# Altium project Megabit revision 2.PrjPcb
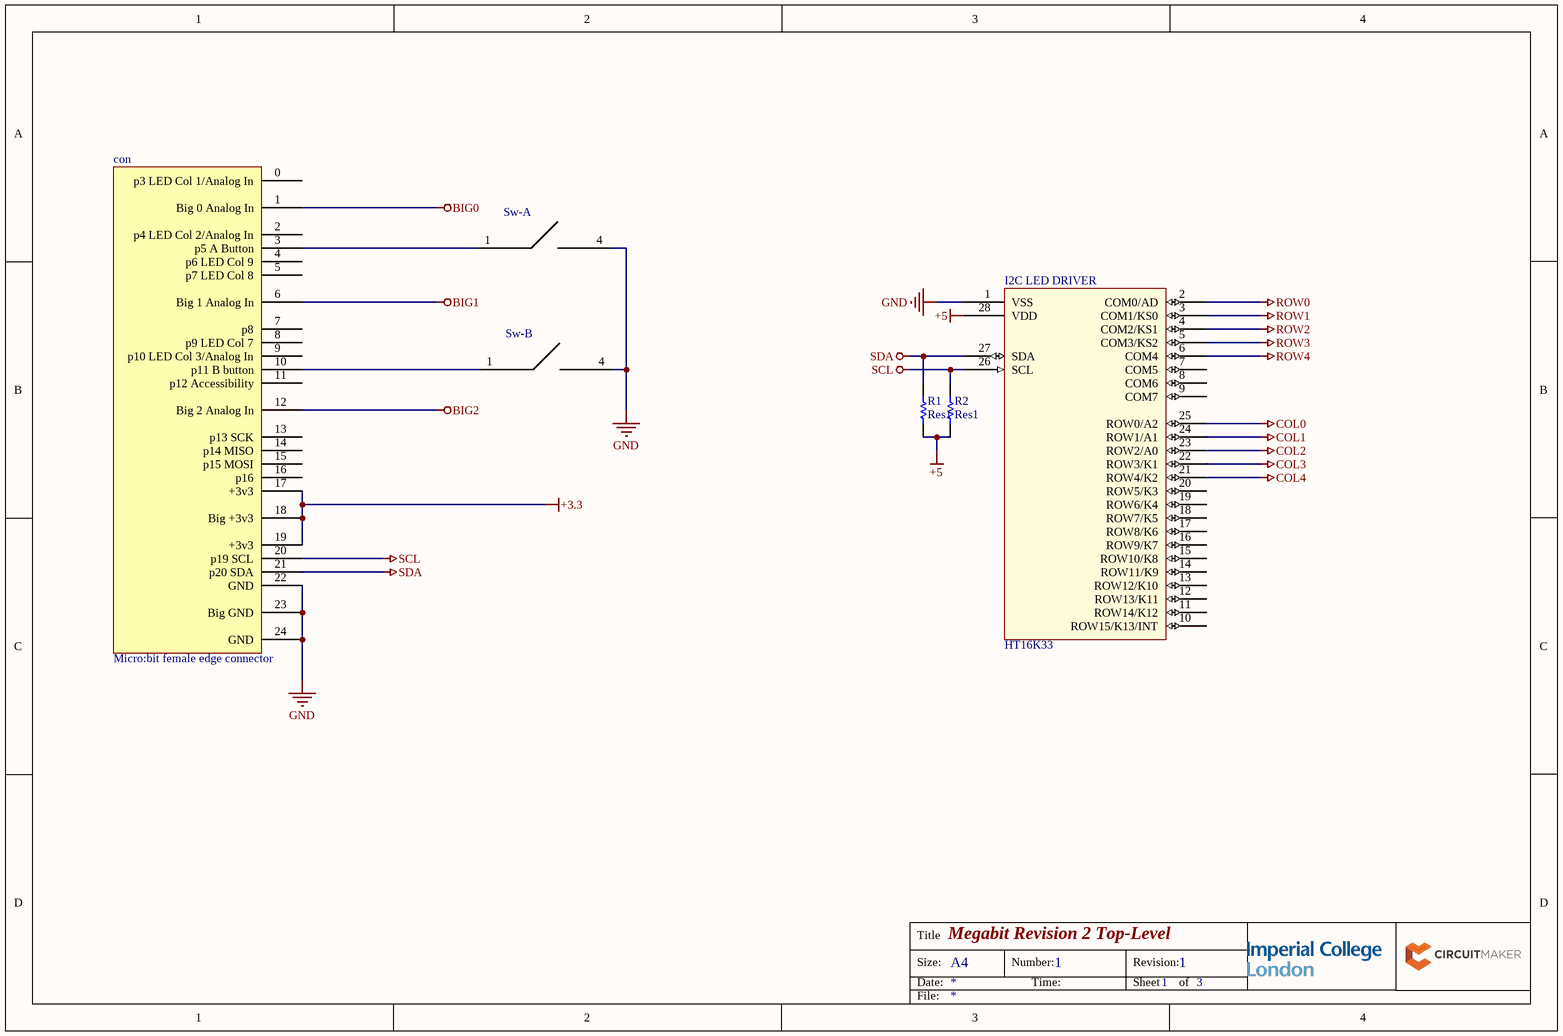
[diagram p0: megabit rev2 top.SchDoc]
3 sheets, 51 parts. Net scope: global (net labels, ports and power ports of the same name join across sheets).
Sheets:
  megabit rev2 top.SchDoc
  LED matrix.SchDoc
  Power.SchDoc

## Sheet megabit rev2 top.SchDoc: Megabit Revision 2 Top-Level
size A4; DrawnBy: Megabit Team; DocumentNumber: 1; Revision: 1; SheetNumber: 1; SheetTotal: 3

### Parts
con  Micro:bit female edge connector  [PCBComponent_1 - duplicate]
I2C_LED_DRIVER  HT16K33  [PCB-otwcc1b496jwxezlenqc-1]
R1  Res1  [PCB-3613466-1]
R2  Res1  [PCB-3613466-1]
Sw-A  TE Connectivity (Tyco Electronics) / ALCOSWITCH FSM4JSMATR  [PCB-1274972-1]  (value not drawn)
Sw-B  TE Connectivity (Tyco Electronics) / ALCOSWITCH FSM4JSMATR  [PCB-1274972-1]  (value not drawn)

### Nets
+3.3: con.17(+3v3) con.18(Big_+3v3) con.19(+3v3)
+5: I2C_LED_DRIVER.28(VDD) R1.1 R2.1
BIG0: con.1(Big_0_Analog_In)
BIG1: con.6(Big_1_Analog_In)
BIG2: con.12(Big_2_Analog_In)
COL0: I2C_LED_DRIVER.25(ROW0/A2)
COL1: I2C_LED_DRIVER.24(ROW1/A1)
COL2: I2C_LED_DRIVER.23(ROW2/A0)
COL3: I2C_LED_DRIVER.22(ROW3/K1)
COL4: I2C_LED_DRIVER.21(ROW4/K2)
GND: con.22(GND) con.23(Big_GND) con.24(GND) I2C_LED_DRIVER.1(VSS) Sw-A.4 Sw-B.4
ROW0: I2C_LED_DRIVER.2(COM0/AD)
ROW1: I2C_LED_DRIVER.3(COM1/KS0)
ROW2: I2C_LED_DRIVER.4(COM2/KS1)
ROW3: I2C_LED_DRIVER.5(COM3/KS2)
ROW4: I2C_LED_DRIVER.6(COM4)
SCL: con.20(p19_SCL) I2C_LED_DRIVER.26(SCL) R2.2
SDA: con.21(p20_SDA) I2C_LED_DRIVER.27(SDA) R1.2
Netcon_3: con.3(p5_A_Button) Sw-A.1
Netcon_10: con.10(p11_B_button) Sw-B.1

Not connected (* = marked no-connect by the designer): con 0(p3_LED_Col_1/Analog_In) 2(p4_LED_Col_2/Analog_In) 4(p6_LED_Col_9) 5(p7_LED_Col_8) 7(p8) 8(p9_LED_Col_7) 9(p10_LED_Col_3/Analog_In) 11(p12_Accessibility) 13(p13_SCK) 14(p14_MISO) 15(p15_MOSI) 16(p16); I2C_LED_DRIVER 7(COM5) 8(COM6) 9(COM7) 10(ROW15/K13/INT) 11(ROW14/K12) 12(ROW13/K11) 13(ROW12/K10) 14(ROW11/K9) 15(ROW10/K8) 16(ROW9/K7) 17(ROW8/K6) 18(ROW7/K5) 19(ROW6/K4) 20(ROW5/K3)

### Notes on the sheet
- Title
- Size:
- Date:
- A4
- Number:
- Time:
- Revision:
- Sheet
- of
- File:

### Library data of the parts
con = CMP-mom7rix79jkpy4z4w6go-14: http://www.dgyuliang.net/html/279.html; CustomComponentID: mom7rix79jkpy4z4w6go
I2C_LED_DRIVER = CMP-58709250411787b7-2: 3M(TM) Stikit(TM) Gold Disc Roll, 01427, 5 in, P100A, 125 discs per roll, 10 rolls per case; REACH SVHC Compliance: No SVHC
R1 R2 = CMP-b15c796618a36e9b-3: Resistor 0.25W; OctopartID: b15c796618a36e9b
Sw-A Sw-B = CMP-1274972-10: SWITCH TACTILE SPST-NO 0.05A 24V; ELV Compliant: Compliant; Contacts Type: SPST; Lead-Free Status: Lead Free; Lifecycle Status: Active; OctopartID: 00c5cb91b7abdf02; RoHS: Compliant; Contact Plating: Silver; Mounting Style: PCB; REACH SVHC Compliance: No SVHC; Octopart Url: https://octopart.com/fsm4jsmatr-alco-1061461; Contact Material: Copper Alloy; Contact Current Rating: 0.05 A; Packaging: Tape & Reel (TR)

## Sheet LED matrix.SchDoc: Megabit LED Matrix
size A4; DocumentNumber: 2; Revision: 1; SheetNumber: 2; SheetTotal: 3
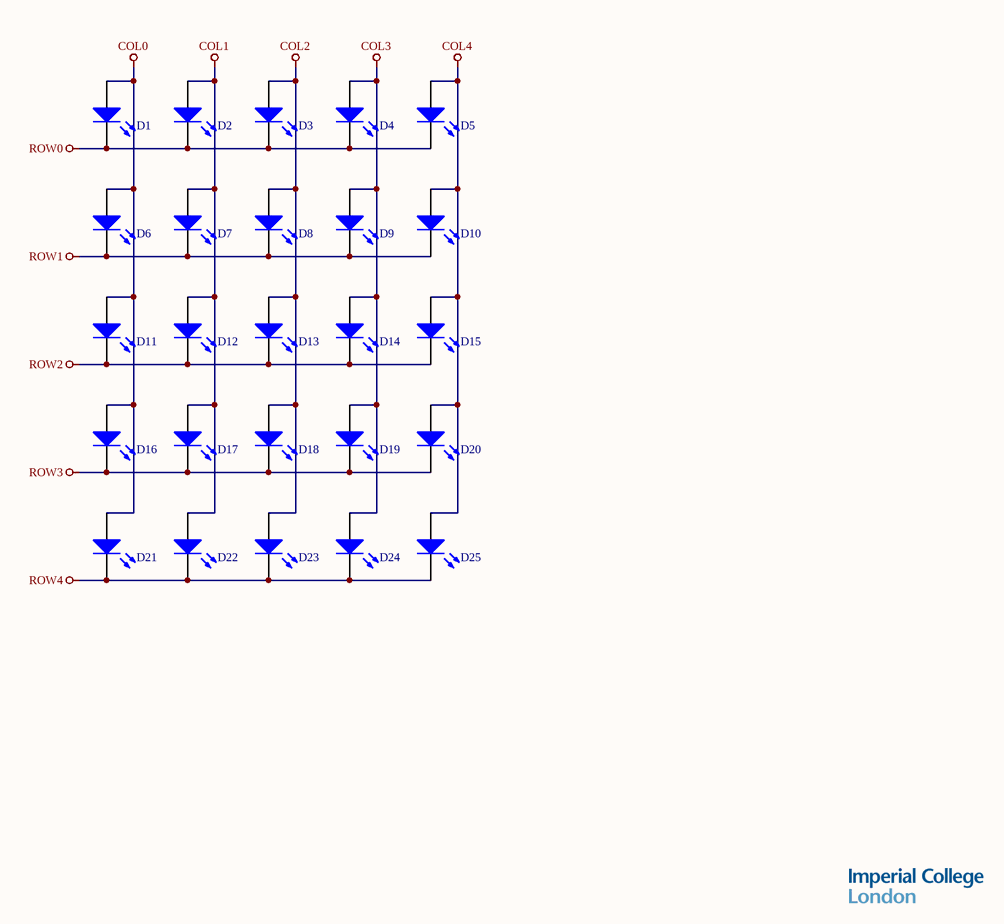
[diagram p1: LED matrix.SchDoc]

### Parts
(Parts that share a designator on the sheet are numbered #1, #2 ... from top to bottom, then left to right.)
D1#1  LED  [PCB-pjce6c538hbnjhyboevm-1]  (value not drawn)
D2  LED  [PCB-pjce6c538hbnjhyboevm-1]  (value not drawn)
D3  LED  [PCB-pjce6c538hbnjhyboevm-1]  (value not drawn)
D4  LED  [PCB-pjce6c538hbnjhyboevm-1]  (value not drawn)
D5  LED  [PCB-pjce6c538hbnjhyboevm-1]  (value not drawn)
D6  LED  [PCB-pjce6c538hbnjhyboevm-1]  (value not drawn)
D7  LED  [PCB-pjce6c538hbnjhyboevm-1]  (value not drawn)
D8  LED  [PCB-pjce6c538hbnjhyboevm-1]  (value not drawn)
D9  LED  [PCB-pjce6c538hbnjhyboevm-1]  (value not drawn)
D10  LED  [PCB-pjce6c538hbnjhyboevm-1]  (value not drawn)
D11  LED  [PCB-pjce6c538hbnjhyboevm-1]  (value not drawn)
D12  LED  [PCB-pjce6c538hbnjhyboevm-1]  (value not drawn)
D13  LED  [PCB-pjce6c538hbnjhyboevm-1]  (value not drawn)
D14  LED  [PCB-pjce6c538hbnjhyboevm-1]  (value not drawn)
D15  LED  [PCB-pjce6c538hbnjhyboevm-1]  (value not drawn)
D16  LED  [PCB-pjce6c538hbnjhyboevm-1]  (value not drawn)
D17  LED  [PCB-pjce6c538hbnjhyboevm-1]  (value not drawn)
D18  LED  [PCB-pjce6c538hbnjhyboevm-1]  (value not drawn)
D19  LED  [PCB-pjce6c538hbnjhyboevm-1]  (value not drawn)
D20  LED  [PCB-pjce6c538hbnjhyboevm-1]  (value not drawn)
D21  LED  [PCB-pjce6c538hbnjhyboevm-1]  (value not drawn)
D22  LED  [PCB-pjce6c538hbnjhyboevm-1]  (value not drawn)
D23  LED  [PCB-pjce6c538hbnjhyboevm-1]  (value not drawn)
D24  LED  [PCB-pjce6c538hbnjhyboevm-1]  (value not drawn)
D25  LED  [PCB-pjce6c538hbnjhyboevm-1]  (value not drawn)

### Nets
COL0: D1#1.1(A) D6.1(A) D11.1(A) D16.1(A) D21.1(A)
COL1: D2.1(A) D7.1(A) D12.1(A) D17.1(A) D22.1(A)
COL2: D3.1(A) D8.1(A) D13.1(A) D18.1(A) D23.1(A)
COL3: D4.1(A) D9.1(A) D14.1(A) D19.1(A) D24.1(A)
COL4: D5.1(A) D10.1(A) D15.1(A) D20.1(A) D25.1(A)
ROW0: D1#1.2(K) D2.2(K) D3.2(K) D4.2(K) D5.2(K)
ROW1: D6.2(K) D7.2(K) D8.2(K) D9.2(K) D10.2(K)
ROW2: D11.2(K) D12.2(K) D13.2(K) D14.2(K) D15.2(K)
ROW3: D16.2(K) D17.2(K) D18.2(K) D19.2(K) D20.2(K)
ROW4: D21.2(K) D22.2(K) D23.2(K) D24.2(K) D25.2(K)

### Notes on the sheet
- Title
- Size:
- Date:
- A4
- Number:
- Time:
- Revision:
- Sheet
- of
- File:

### Library data of the parts
D1#1 D2-D25 = CMP-c7440e1cac271883-2: L-793SRD-E, Round Series Red LED, 640 nm 8 mm, Round Lens Through Hole package; Lens Type: Diffused; Viewing Angle: 30 °; Wavelength: 640 nm; Octopart URL: https://octopart.com/l-793srd-e-kingbright-5393925; Operating Temperature: -40.0 °C to 85.0 °C; RoHS: Compliant; Mounting Style: Through Hole, PCB; REACH SVHC Compliance: No SVHC; Manufacturer Part Number: L-793SRD-E

## Sheet Power.SchDoc: Megabit Revision 2 Power
size A4; DocumentNumber: 3; Revision: 1; SheetNumber: 3; SheetTotal: 3
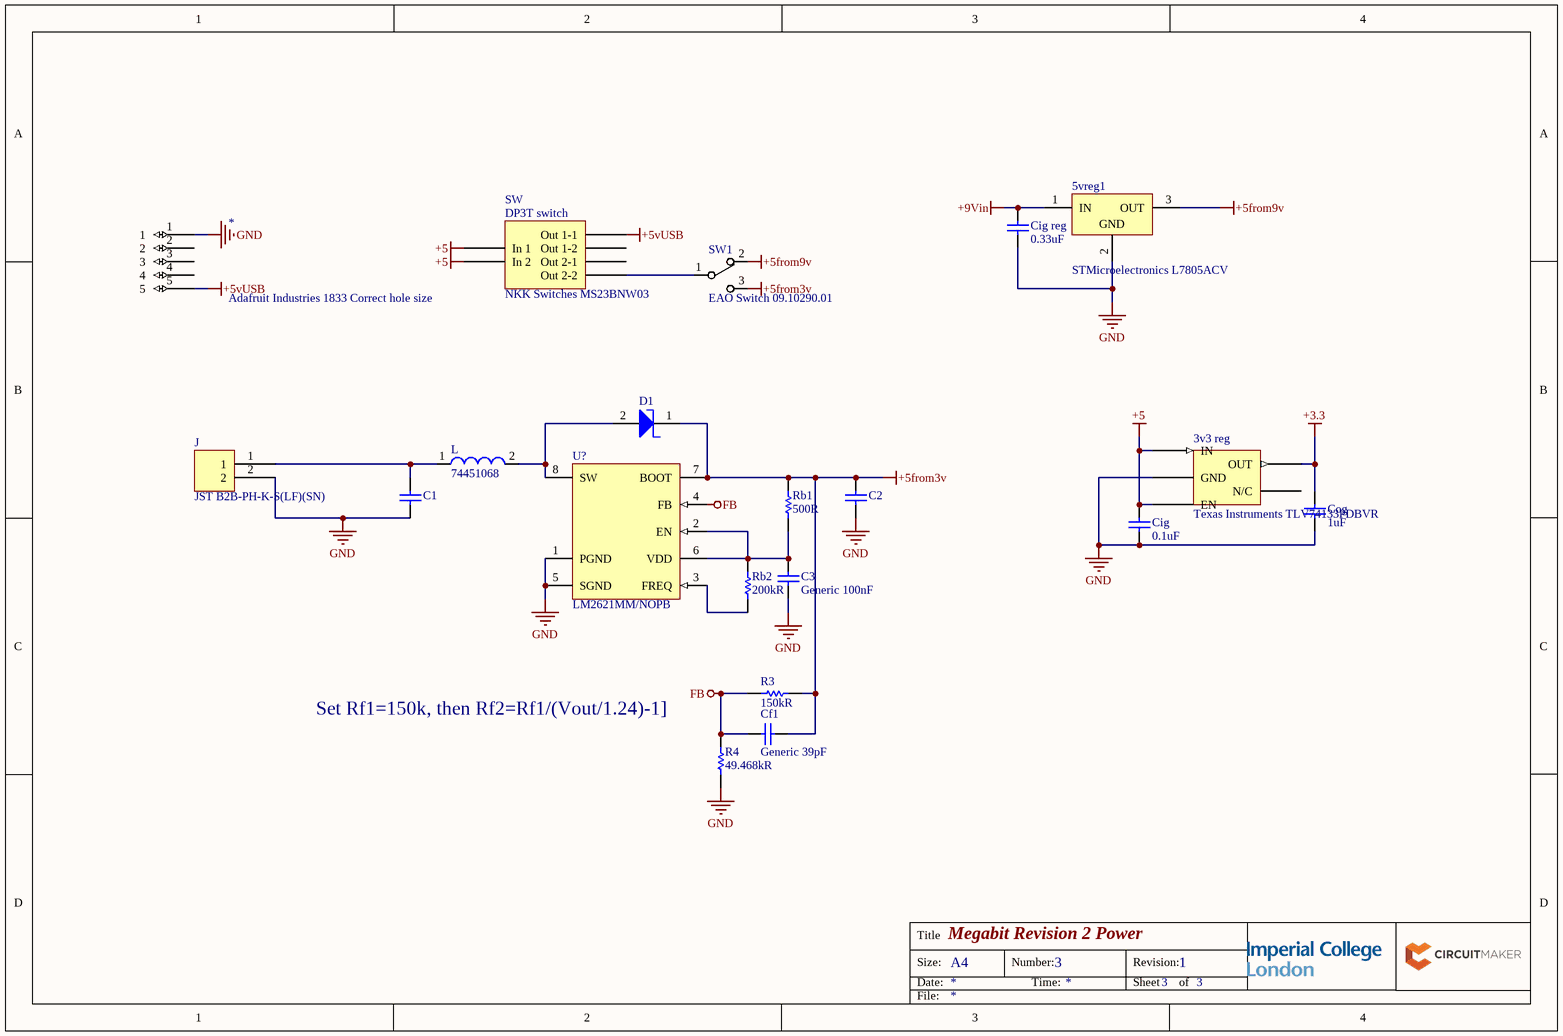
[diagram p2: Power.SchDoc]

### Parts
(Parts that share a designator on the sheet are numbered #1, #2 ... from top to bottom, then left to right.)
3v3_reg  Texas Instruments TLV74133PDBVR  [PCB-e30blpvsozc7nnftiis2-1]
5vreg1  STMicroelectronics L7805ACV  [PCB-rumztmkd2xxusznmwboq-1]
*  Adafruit Industries 1833 Correct hole size  [PCB-lrx1ysvqy1j2hi3n37c6-1]
C1  Vishay 595D226X06R3B2T 22uf  [PCB-awioszezn6dp9j1rjqrs-1]  (value not drawn)
C2  Vishay 595D686X0010C2T 68uf  [PCB-d73fplpdo6xzmazju0mb-1]  (value not drawn)
C3  Generic 100nF  [CAPC3225X270X50NL20T25]
Cf1  Generic 39pF  [CAPC3225X270X50NL20T25]
Cig  0.1uF  [Vishay K104K15X7RF5TL2]
Cig_reg  0.33uF  [Vishay K104K15X7RF5TL2]
Cog  1uF  [Vishay K104K15X7RF5TL2]
D1#2  Diode  [PCB-z7pk77sri5opvcrttliy-1]  (value not drawn)
J  JST B2B-PH-K-S(LF)(SN)  [PCB-gpdi66yn1jko56crxrq7-1]
L  74451068  [WE-PD3-S]
R3  150kR  [PCB-3613466-1]
R4  49.468kR  [PCB-3613466-1]
Rb1  500R  [PCB-3613466-1]
Rb2  200kR  [PCB-3613466-1]
SW  NKK Switches MS23BNW03  [PCB-eozfiwzr1uk89188ni00-1]
SW1  EAO Switch 09.10290.01  [PCB-1akl86m7w5ikau1ha4dm-1]
U?  LM2621MM/NOPB  [MUA08A_M]

### Nets
+3.3: 3v3_reg.4(OUT) Cog.2
+5: 3v3_reg.1(IN) 3v3_reg.3(EN) Cig.2 SW.2(In_1) SW.5(In_2)
+5from3v: C2.2 Cf1.1 D1#2.1(K) R3.1 Rb1.2 SW1.3 U?.7(BOOT)
+5from9v: 5vreg1.3(OUT) SW1.2
+5vUSB: *.5 SW.1(Out_1-1)
+9Vin: 5vreg1.1(IN) Cig_reg.2
FB: Cf1.2 R3.2 R4.1 U?.4(FB)
GND: 3v3_reg.2(GND) 5vreg1.2(GND) *.1 C1.1 C2.1 C3.1 Cig.1 Cig_reg.1 Cog.1 J.2 R4.2 U?.1(PGND) U?.5(SGND)
NetC1_2: C1.2 J.1 L.1
NetC3_2: C3.2 Rb1.1 Rb2.2 U?.2(EN) U?.6(VDD)
NetD1#2_2: D1#2.2(A) L.2 U?.8(SW)
NetRb2_1: Rb2.1 U?.3(FREQ)
NetSW_6: SW.6(Out_2-2) SW1.1

Not connected (* = marked no-connect by the designer): 3v3_reg 5(N/C); * 2 3 4; SW 3(Out_1-2) 4(Out_2-1)

### Notes on the sheet
- (near R4) Set Rf1=150k, then Rf2=Rf1/(Vout/1.24)-1]
- Title
- Size:
- Date:
- A4
- Number:
- Time:
- Revision:
- Sheet
- of
- File:
- (in symbol CMP-e82c21266ecb37eb-4) DP3T switch

### Library data of the parts
3v3_reg = CMP-ad66616159c672a1-4: 150mA Low-Dropout (LDO) Regulator With Foldback Current Limit for Portable Devices 5-SOT-23 -40 to 125; Dropout Voltage: 230 mV; Quiescent Current: 50.0 µA; Number of Regulated Outputs: 1; Output Capacitor Type: Ceramic; RoHS: Compliant; Octopart URL: https://octopart.com/tlv74133pdbvr-texas+instruments-84791750; Operating Temperature: -40.0 °C to 125 °C; OctopartID: ad66616159c672a1; Manufacturer Part Number: TLV74133PDBVR; Number of Pins: 5; Lifecycle Status: Pre-Release; Case/Package: SOT-23
5vreg1 = CMP-1170713-16: L7805 Series 1.5 A 5 V Three Terminal Voltage Regulator - TO-220; Dropout Voltage: 2.00 V; Output Voltage: 5.00 V (max); Number of Outputs: 1; Input Voltage (DC): 20.0 V (max); Lead-Free Status: Lead Free; Output Current: 1.00 A, 1.50 A; OctopartID: b0837beb020f6f44; Operating Temperature: 0.00 °C to 150 °C; Mounting Style: Through Hole; Manufacturer Part Number: L7805ACV; Lifecycle Status: Active; REACH SVHC Compliance: No SVHC; Case/Package: TO-220; RoHS: Compliant; Number of Pins: 3; Packaging: Tube; Octopart URL: https://octopart.com/l7805acv-stmicroelectronics-40015850
* = CMP-bfb17591a6f36076-2: Standoff; Threaded Female 1/4 Hex; 6-32 Thread; Length .875; Brass/Zinc; Manufacturer Part Number: 1833; Lead-Free Status: Lead Free; OctopartID: bfb17591a6f36076; Size-Width: 6.35 mm; Size-Diameter: 6.35 mm; Octopart URL: http://octopart.com/1833-adafruit+industries-53099556; Material: Brass; Size-Length: 22.2 mm; Gender: Female; RoHS: Compliant
C1 = CMP-0470cff745dfdbb7-1: Cap Tant Solid 22uF 6.3V B CASE 20% (4 X 2.8 X 1.9mm) SMD 0.57 Ohm 125°C T/R; Octopart URL: https://octopart.com/595d226x06r3b2t-vishay-42820809; Manufacturer Part Number: 595D226X06R3B2T; Mounting Style: Surface Mount; Packaging: Reel; OctopartID: 0470cff745dfdbb7
C2 = CMP-af556406ccca7092-1: Capacitor; Tantalum; Cap 68 uF; Tol 20%; Vol-Rtg 10 VDC; SMT; ESR 0.24 Ohms; Case C; Capacitance: 68.0 µF; Equivalent Series Resistance (ESR): 240 m?; Lead-Free Status: Lead Free; Voltage Rating (DC): 10.0 V; Octopart URL: https://octopart.com/595d686x0010c2t-vishay-39405305; Manufacturer Part Number: 595D686X0010C2T; Capacitance Tolerance: ±20%; Dielectric Material: Tantalum; Mounting Style: Surface Mount, PCB; Operating Temperature: -55.0 °C to 85.0 °C; Packaging: Reel; Number of Pins: 2; RoHS: Compliant; OctopartID: af556406ccca7092
C3 Cf1 = CMP-7582759-2: Cap Ceramic 22uF 6.3V X7R 10% SMD 1210 125C Plastic T/R; Capacitance: 2.2e-05 F; Lead-Free Status: R; Capacitance Tolerance: ±10%; Case/Package: 1210; Dielectric Characteristic: X7R; Dielectric Material: Ceramic; Mounting Style: Surface Mount; Octopart Url: https://octopart.com/c1210c226k9rac7800-kemet-25529306; OctopartID: 3960f1ef97dce6a7; RoHS: Compliant; Voltage Rating (DC): 6.3 V
Cig Cig_reg Cog = CMP-124240-16: K Series 100nF 50 V ±10 % Tolerance X7R Radial Multilayer Ceramic Capacitor; Manufacturer Part Number: K104K15X7RF5TL2; Lead Length: 30mm; Lead-Free Status: Lead Free; Voltage Rating (DC): 50 V; Capacitance Tolerance: ±10%; Size-Height: 5.6mm; Size-Width: 4.0mm; Mounting Style: Through Hole; OctopartID: e7292e20c87538ee; Number of Pins: 2; Packaging: Cut Tape (CT), Tape & Reel (TR); Capacitance: 100 nF; Octopart URL: http://octopart.com/k104k15x7rf5tl2-vishay+bccomponents-199226; Dielectric Material: Ceramic; Dielectric Characteristic: X7R; Size-Lead Diameter: 0.5mm; RoHS: Compliant; Size-Thickness: 2.6mm
D1#2 = CMP-816651-5: Schottky Power Rectifier, 2-Pin SMB, Pb-Free, Tape and Reel; Current Rating: 1.0 A; Lead-Free Status: Lead Free; REACH SVHC Compliance: No SVHC; OctopartID: 7211bb1b496aadd6; Number of Pins: 2; Halogen Free Status: Halogen Free
J = CMP-642947-7: PH Series 2 Position 2 mm Pitch Through Hole Top Entry Shrouded Header; Number of Contacts: 2; Pin Pitch: 2.00 mm; Lead-Free Status: Lead Free; Current Rating: 2.00 A; Insulation Resistance: 1.00 MΩ; Contact Resistance: 10.0 mΩ; Gender: Male; Voltage Rating (AC): 100 V; Size-Height: 6.00 mm; Octopart URL: http://octopart.com/b2b-ph-k-s%28lf%29%28sn%29-jst-248868; OctopartID: a21c6b154b5e7ddb; Number of Positions: 2; REACH SVHC Compliance: No SVHC; Mounting Style: Through Hole, Vertical; Size-Width: 4.50 mm; Size-Length: 5.90 mm; RoHS: Compliant; Manufacturer Part Number: B2B-PH-K-S(LF)(SN); Contact Material: Brass; Housing Color: Natural; Packaging: Bulk; Number of Rows: 1; Housing Material: Nylon; Contact Plating: Tin
L = CMP-2520931-2: SMD Shielded Power Inductor WE-PD3, L = 6.80 µH; Inductance: 6.8e-06 H; Resistance: 0.055 Ω; Resonant Frequency: 50000000.0 Hz; Number of Pins: 2; Octopart Url: https://octopart.com/74451068-w%C3%BCrth+elektronik-8917248; OctopartID: 2a29e3ab1e4ff5ee; Packaging: Cut Tape (CT); REACH SVHC Compliance: No SVHC; RoHS: Compliant; Self Resonant Frequency: 50000000.0 Hz
R3 R4 Rb1 Rb2 = CMP-b15c796618a36e9b-3: Resistor 0.25W; OctopartID: b15c796618a36e9b
SW = CMP-e82c21266ecb37eb-4: dp3t on off on switch
SW1 = CMP-a30d6b12014b7cca-5: SLIDE SWITCH, SPDT, HORIZ; Series: 1K2; Switch Function Type: SPDT, R/A; Contact Configuration: SPDT; Voltage, Contac...; Insulation Resistance: 10.0 GΩ; Contact Resistance: 22.0 mΩ; Octopart URL: http://octopart.com/09.10290.01-eao+switch-18188064; Manufacturer Part Number: 09.10290.01; Orientation: Right Angle; RoHS: Compliant; Mounting Style: PCB; Contacts Type: SPDT; OctopartID: a30d6b12014b7cca
U? = CMP-0069-01749-4: Low Input Voltage, Step-Up DC-DC, 8-pin MSOP, Pb-Free; Output Voltage: 14.0 V; Number of Outputs: 1; Quiescent Current: 8e-05 A; Lead-Free Status: Lead Free; Output Current: 1.0 A; Frequency: 2000000.0 Hz; Octopart Url: https://octopart.com/lm2621mm%2Fnopb-texas+instruments-24812996; Mounting Style: Surface Mount; Number of Regulated Outputs: 1; Lifecycle Status: Active; RoHS: Compliant; Case/Package: MSOP; Packaging: Cut Tape (CT); OctopartID: 8eac46dc360e516b; Number of Pins: 8; REACH SVHC Compliance: No SVHC

## Nets that join several sheets
+3.3: megabit rev2 top (con.17 con.18 con.19), Power (3v3_reg.4 Cog.2)
+5: megabit rev2 top (I2C_LED_DRIVER.28 R1.1 R2.1), Power (5 pins)
COL0: megabit rev2 top (I2C_LED_DRIVER.25), LED matrix (5 pins)
COL1: megabit rev2 top (I2C_LED_DRIVER.24), LED matrix (5 pins)
COL2: megabit rev2 top (I2C_LED_DRIVER.23), LED matrix (5 pins)
COL3: megabit rev2 top (I2C_LED_DRIVER.22), LED matrix (5 pins)
COL4: megabit rev2 top (I2C_LED_DRIVER.21), LED matrix (5 pins)
GND: megabit rev2 top (6 pins), Power (13 pins)
ROW0: megabit rev2 top (I2C_LED_DRIVER.2), LED matrix (5 pins)
ROW1: megabit rev2 top (I2C_LED_DRIVER.3), LED matrix (5 pins)
ROW2: megabit rev2 top (I2C_LED_DRIVER.4), LED matrix (5 pins)
ROW3: megabit rev2 top (I2C_LED_DRIVER.5), LED matrix (5 pins)
ROW4: megabit rev2 top (I2C_LED_DRIVER.6), LED matrix (5 pins)